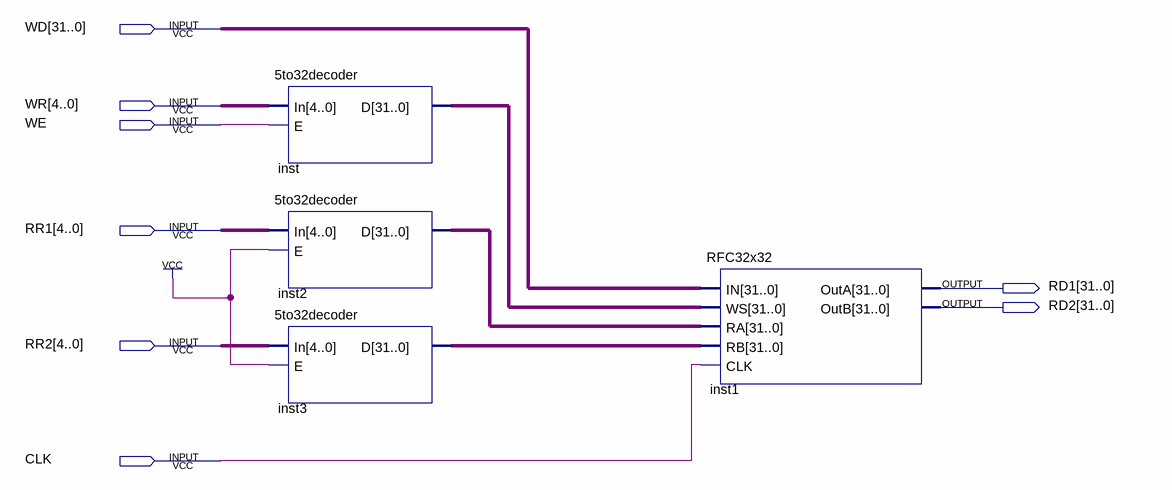
[diagram p0: schematic sheet]
// Quartus schematic RF32x32.bdf as structural Verilog: 4 symbols, 8 pins
module RF32x32 (
  input  [31:0] WD,
  input  [4:0] WR,
  input  WE,
  input  [4:0] RR1,
  input  [4:0] RR2,
  input  CLK,
  output [31:0] RD1,
  output [31:0] RD2
);

  wire [31:0] inst2_d, inst3_d, inst_d;

  \5to32decoder  inst (.In(WR), .E(WE), .D(inst_d));
  \5to32decoder  inst2 (.In(RR1), .E(1'b1), .D(inst2_d));
  \5to32decoder  inst3 (.In(RR2), .E(1'b1), .D(inst3_d));
  RFC32x32 inst1 (.IN(WD), .WS(inst_d), .RA(inst2_d), .RB(inst3_d), .CLK(CLK), .OutA(RD1), .OutB(RD2));
endmodule
